# Altium schematic sheet Power_Controller.SchDoc
size A4; SheetNumber: 1; SheetTotal: 1
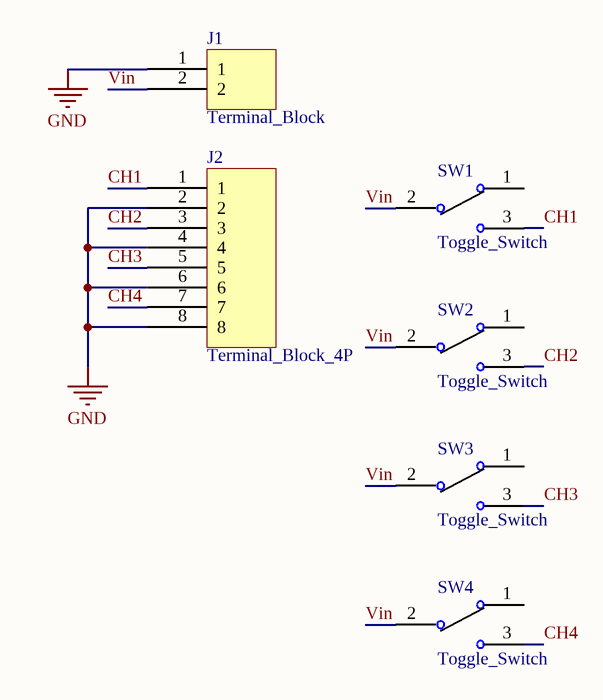
[diagram p0: Power_Controller.SchDoc]

## Parts
J1  Terminal_Block  [terminal_block_2P_V2]
J2  Terminal_Block_4P  [terminal_block_4P]
SW1  Toggle_Switch  [T_Switch_V1]
SW2  Toggle_Switch  [T_Switch_V1]
SW3  Toggle_Switch  [T_Switch_V1]
SW4  Toggle_Switch  [T_Switch_V1]

## Nets
GND: J1.1 J2.2 J2.4 J2.6 J2.8
CH1: J2.1 SW1.3
CH2: J2.3 SW2.3
CH3: J2.5 SW3.3
CH4: J2.7 SW4.3
Vin: J1.2 SW1.2 SW2.2 SW3.2 SW4.2

Not connected (* = marked no-connect by the designer): SW1 1; SW2 1; SW3 1; SW4 1

## Library data of the parts
J1 = Terminal_Block_2P
SW1-SW4 = Switch_T